# Altium schematic sheet Audio Memory.SchDoc: Audio Memory
size A4; Organization: Altium Limited; Address1: L3, 12a Rodborough Rd; Address2: Frenchs Forest; Address3: NSW; Address4: Australia 2086; Revision: 1; SheetNumber: 7; SheetTotal: 11; Alumno: Diego Caceres; Curso: R1051; Materia: Sistemas de Representación; Docentes: Ing. Perdomo, Ing. Fuoco, Ing. Giorno, Sr. Vergili
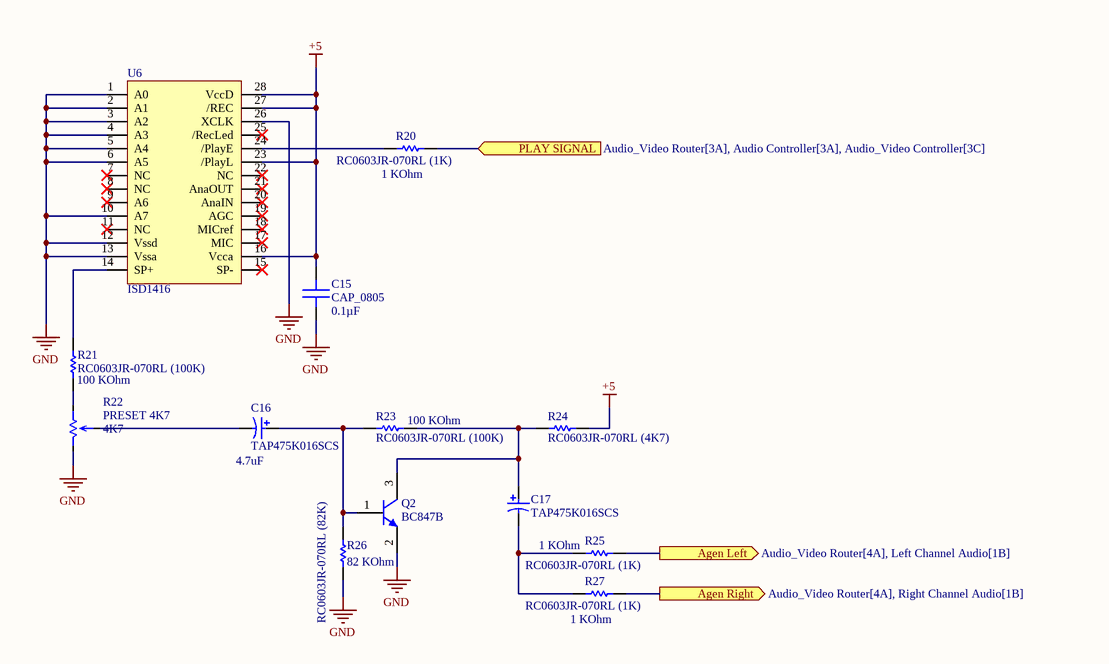
[diagram p0: Audio Memory.SchDoc]

## Parts
C15  CAP_0805  value 0.1µF  [0805_CAPACITOR_DCACERES]
C16  TAP475K016SCS  Capacitance: 4.7uF  [AVX-TAP475K016SCS]
C17  TAP475K016SCS  [AVX-TAP475K016SCS]
Q2  BC847B  [INF-SOT23_M]
R20  RC0603JR-070RL (1K)  Resistance: 1 KOhm  [RESC1608X55X25ML10T15]
R21  RC0603JR-070RL (100K)  Resistance: 100 KOhm  [RESC1608X55X25ML10T15]
R22  PRESET 4K7  value 4K7  [3386P_PRESET_4K7_DCaceres]
R23  RC0603JR-070RL (100K)  Resistance: 100 KOhm  [RESC1608X55X25ML10T15]
R24  RC0603JR-070RL (4K7)  [RESC1608X55X25ML10T15]
R25  RC0603JR-070RL (1K)  Resistance: 1 KOhm  [RESC1608X55X25ML10T15]
R26  RC0603JR-070RL (82K)  Resistance: 82 KOhm  [RESC1608X55X25ML10T15]
R27  RC0603JR-070RL (1K)  Resistance: 1 KOhm  [RESC1608X55X25ML10T15]
U6  ISD1416  [28-Lead_0.600-Inch_PDIP_ISD1416_DCACERES]

## Ports
Agen Left (out, see Audio_Video Router[4A], Left Channel Audio[1B]), Agen Right (out, see Audio_Video Router[4A], Right Channel Audio[1B]), PLAY SIGNAL (in, see Audio_Video Router[3A], Audio Controller[3A], Audio_Video Controller[3C])

## Nets
+5: C15.2 R24.2 U6.16(Vcca) U6.23(/PlayL) U6.27(/REC) U6.28(VccD)
GND: C15.1 Q2.2(E) R22.1 R26.2 U6.1(A0) U6.2(A1) U6.3(A2) U6.4(A3) U6.5(A4) U6.6(A5) U6.10(A7) U6.12(Vssd) U6.13(Vssa) U6.26(XCLK)
Agen Left: R25.1 ; port Agen Left
Agen Right: R27.1 ; port Agen Right
PLAY SIGNAL: R20.1 ; port PLAY SIGNAL
NetC16_1: C16.1 Q2.1(B) R23.1 R26.1
NetC16_2: C16.2 R22.3
NetC17_1: C17.1 Q2.3(C) R23.2 R24.1
NetC17_2: C17.2 R25.2 R27.2
NetR20_2: R20.2 U6.24(/PlayE)
NetR21_1: R21.1 U6.14(SP+)
NetR21_2: R21.2 R22.2

Not connected (* = marked no-connect by the designer): U6 7(NC)* 8(NC)* 9(A6)* 11(NC)* 15(SP-)* 17(MIC)* 18(MICref)* 19(AGC)* 20(AnaIN)* 21(AnaOUT)* 22(NC)* 25(/RecLed)*

## Notes on the sheet
- Title:
- Revision:
- Alumno:
- Materia:
- Docentes:
- Curso:
- File:
- Date:
- Sheet
- of

## Library data of the parts
C15 = CAPACITOR_0805_Caceres: Capacitor SMD, encapsulado 0805; SizePackage: 0805; ComponentLink1Description: Datasheet1; ComponentLink1URL: https://www.mouser.com/datasheet/2/40/AutoMLCCKAM-3216307.pdf; ComponentLink2Description: Datasheet2; ComponentLink2URL: https://www.mouser.com/datasheet/2/447/KEM_C1086_U2J-3316409.pdf; ComponentLink3Description: Datasheet3; ComponentLink3URL: https://product.tdk.com/system/files/dam/doc/product/capacitor/ceramic/mlcc/catalog/mlcc_commercial_soft_en.pdf
C16 = CMP-2000-07562-1: Dipped Radial Capacitor, 4.7 uF, +/- 10%, 16 V, -55 to 125 degC, RoHS, Bulk; Manufacturer: AVX; Life (Hours): 1000Hour; Dissipation Factor: 6%; Voltage: 16V; Polarity: Polar; ESR (Equivalent Series Resistance): 5Ohm; Lead Diameter: 0.5mm; Dielectric Material: Tantalum; Leakage Current: 600nA; Mounting Technology: ThroughHole; Tolerance: 10%; Number of Pins: 2; REACH SVHC: NoSVHC; RoHSCompliant: True; Min Operating Temperature: -55degC; Packaging: Bulk; Termination: Radial; Case\/Package: Dipped; Lead Free: LeadFree; Voltage Rating: 16V; Radiation Hardening: No; Package Quantity: 1000; Voltage Rating (DC): 16V; Height - Seated (Max): 0.295inch; Mount: PCB; Max Operating Temperature: 125degC; Datasheet URL: http://datasheets.avx.com/tap.pdf; Datasheet Version: 08/2015; Manufacturer URL: http://www.avx.com/; Package Reference: TAP475K016SCS; Lead Pitch: 2.5mm; Length: 7.5mm; Package Description: 2-Pin Through Hole Device, Dia 4.5 mm, Height 7.5 mm; Height: 7.5mm; Diameter: 4.5mm
C17 = CMP-2000-07562-1: Dipped Radial Capacitor, 4.7 uF, +/- 10%, 16 V, -55 to 125 degC, RoHS, Bulk; Manufacturer: AVX; Life (Hours): 1000Hour; Dissipation Factor: 6%; Voltage: 16V; Polarity: Polar; ESR (Equivalent Series Resistance): 5Ohm; Lead Diameter: 0.5mm; Dielectric Material: Tantalum; Capacitance: 4.7uF; Leakage Current: 600nA; Mounting Technology: ThroughHole; Tolerance: 10%; Number of Pins: 2; REACH SVHC: NoSVHC; RoHSCompliant: True; Min Operating Temperature: -55degC; Packaging: Bulk; Termination: Radial; Case\/Package: Dipped; Lead Free: LeadFree; Voltage Rating: 16V; Radiation Hardening: No; Package Quantity: 1000; Voltage Rating (DC): 16V; Height - Seated (Max): 0.295inch; Mount: PCB; Max Operating Temperature: 125degC; Datasheet URL: http://datasheets.avx.com/tap.pdf; Datasheet Version: 08/2015; Manufacturer URL: http://www.avx.com/; Package Reference: TAP475K016SCS; Lead Pitch: 2.5mm; Length: 7.5mm; Package Description: 2-Pin Through Hole Device, Dia 4.5 mm, Height 7.5 mm; Height: 7.5mm; Diameter: 4.5mm
Q2 = CMP-1177-00042-1: NPN Silicon AF Transistor, 45 V VCEO, 100 mA IC, SOT23, Reel, Green; Manufacturer: Infineon; VEBO (max): 6Â V; ICBO (max): 15Â nA; VCBO (max): 50Â V; IBM (max): 200Â mA; Green: TRUE; Ptot (max): 330Â mW; fT (typ): 250Â MHz; IC (max): 100Â mA; VCEO (max): 45Â V; PackageDescription: 3-Pin Small Outline Transistor Package, 1.3 x 2.9 mm Body, 0.95 mm Pitch; ComponentLink3URL: http://www.infineon.com/dgdl/SOT23-Package_Overview.pdf?folderId=db3a30431936bc4b0119532290053c66&fileId=db3a30431936bc4b0119533468123c85; PackageVersion: Apr-08; Packing: Reel; ComponentLink3Description: Package Specification; ComponentLink2URL: http://www.infineon.com/dgdl/bc847series_bc848series_bc849series_bc850series.pdf?folderId=db3a304314dca389011541d30fa21656&fileId=db3a304314dca389011541d4630a1657; ComponentLink1URL: http://www.infineon.com/; ComponentLink2Description: Datasheet; Polarity: NPN; Mounting Technology: Surface Mount; PackageReference: SOT23; ICM (max): 200Â mA; ComponentLink1Description: Manufacturer URL; PartNumber: BC847B
R20 R21 R23 R25-R27 = CMP-2100-03667-1: Chip Resistor, 0 Ohm, +/- 5%, 0.1 W, -55 to 155 degC, 0603 (1608 Metric), RoHS, Tape and Reel; Manufacturer: Yageo; Temperature Coefficient: 200ppm/degreesC; Voltage Rating: 50V; Power Rating: 100mW; Width: 0.8mm; Max Operating Temperature: 155degC; Tolerance: 5%; Package Reference: 0603; Height: 0.45mm; Depth: 0.8mm; Package Description: 2-Pin Surface Mount Device, Body 1.6 x 0.8 mm; Termination: SMD/SMT; Package Quantity: 5000; Case/Package: 0603; Case Code (Imperial): 0603; Radiation Hardening: No; Number of Pins: 2; Length: 1.6mm; Lead Free: LeadFree; Voltage Rating (DC): 50V; Military Standard: Not; Datasheet URL: http://www.yageo.com/NewPortal/yageodocoutput?fileName=/pdf/R-Chip/PYu-RC_Group_51_RoHS_L_5.pdf; Manufacturer URL: http://www.yageo.com/; Packaging: TapeandReel; Case Code (Metric): 1608; Min Operating Temperature: -55degC; Composition: ThickFilm; RoHSCompliant: true; Contact Plating: Tin; Datasheet Version: Rev. 5, 10/2016; REACH SVHC: NoSVHC
R22 = Preset_4K7_Caceres: Preset 4K7, Thru HoleManufacturer Part Search 3386P-1-472LF; PartNumber: 3386P-1-472LF; ComponentLink1Description: Package Specification; ComponentLink1URL: https://ar.mouser.com/datasheet/2/54/3386-776606.pdf; ComponentLink2Description: URL Link; ComponentLink2URL: https://www.mouser.com/ProductDetail/Bourns/3386P-1-472LF?qs=g1MxsQ5vwlSvqan31esVSg%3D%3D
R24 = CMP-2100-03667-1: Chip Resistor, 0 Ohm, +/- 5%, 0.1 W, -55 to 155 degC, 0603 (1608 Metric), RoHS, Tape and Reel; Manufacturer: Yageo; Temperature Coefficient: 200ppm/degreesC; Voltage Rating: 50V; Power Rating: 100mW; Resistance: 0mOhm; Width: 0.8mm; Max Operating Temperature: 155degC; Tolerance: 5%; Package Reference: 0603; Height: 0.45mm; Depth: 0.8mm; Package Description: 2-Pin Surface Mount Device, Body 1.6 x 0.8 mm; Termination: SMD/SMT; Package Quantity: 5000; Case/Package: 0603; Case Code (Imperial): 0603; Radiation Hardening: No; Number of Pins: 2; Length: 1.6mm; Lead Free: LeadFree; Voltage Rating (DC): 50V; Military Standard: Not; Datasheet URL: http://www.yageo.com/NewPortal/yageodocoutput?fileName=/pdf/R-Chip/PYu-RC_Group_51_RoHS_L_5.pdf; Manufacturer URL: http://www.yageo.com/; Packaging: TapeandReel; Case Code (Metric): 1608; Min Operating Temperature: -55degC; Composition: ThickFilm; RoHSCompliant: true; Contact Plating: Tin; Datasheet Version: Rev. 5, 10/2016; REACH SVHC: NoSVHC
U6 = ISD1416_Caceres: ISD1416P, Thru Hole / IC MEM VOICE REC/PLAY 16S 28DIP / 28-Lead 0.600-Inch Plastic Dual Inline Package (PDIP); Manufacturer: Nuvoton; ComponentLink1Description: Datasheet1; ComponentLink1URL: https://pdf1.alldatasheet.com/datasheet-pdf/view/80293/ETC/ISD1416.html; PartNumber: ISD1416P; Package: PDIP-28; ComponentLink2Description: Datasheet2; ComponentLink2URL: https://datasheet.ciiva.com/1788/isd1400-rev1-3-1788428.pdf?src-supplier=Digi-Key